# EAGLE design controller2 (EAGLE 6.3)
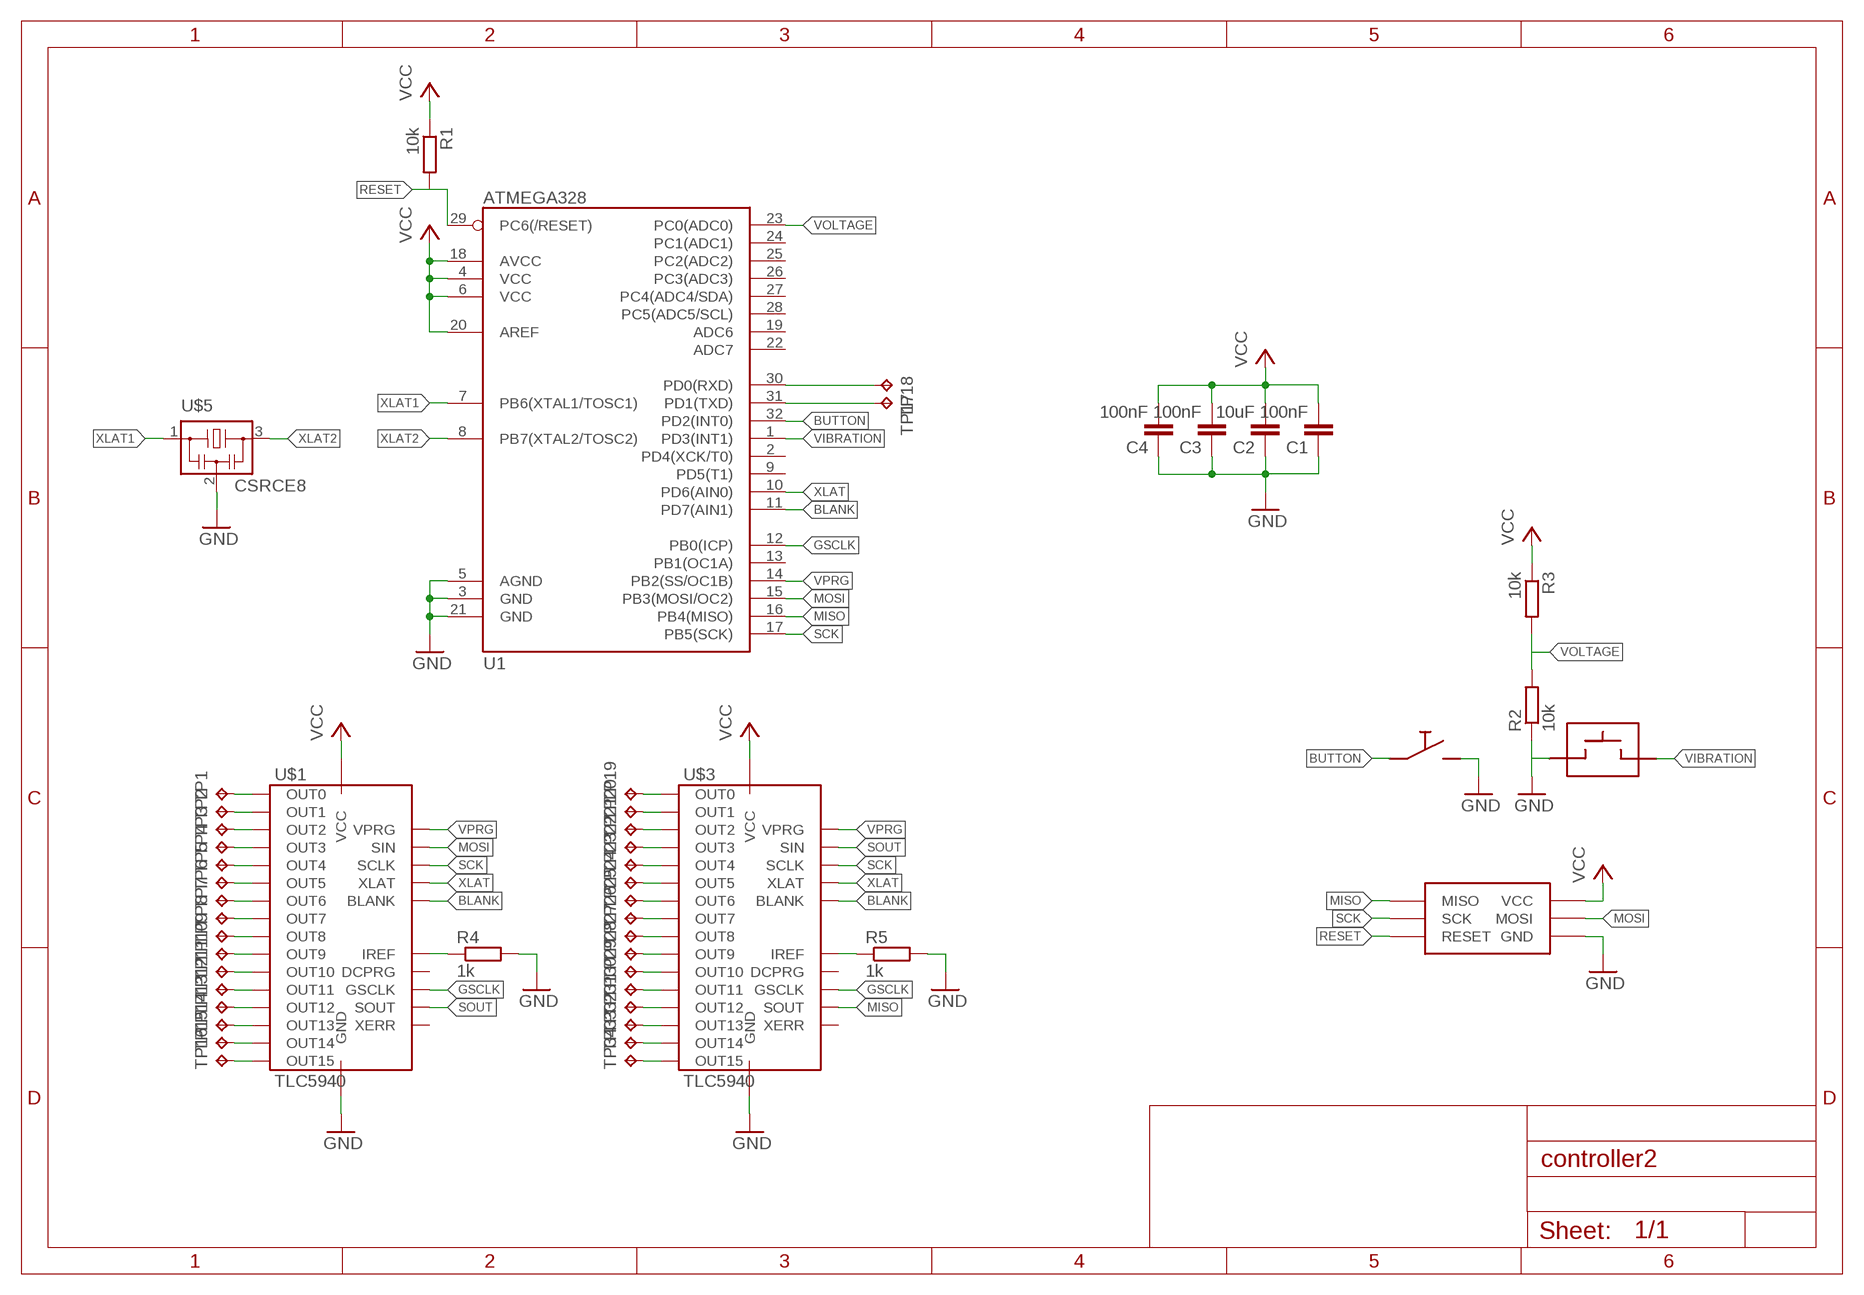
[diagram p0: schematic, sheet 1]

## Parts
C1  100nF  C-EUC0603  [C0603]
C2  10uF  C-EUC0805  [C0805]
C3  100nF  C-EUC0603  [C0603]
C4  100nF  C-EUC0603  [C0603]
R1  10k  R-EU_R0603  [R0603]
R2  10k  R-EU_R0603  [R0603]
R3  10k  R-EU_R0603  [R0603]
R4  1k  R-EU_R0603  [R0603]
R5  1k  R-EU_R0603  [R0603]
TP1  TPTP15SQ  [TP15SQ]
TP2  TPTP15SQ  [TP15SQ]
TP3  TPTP15SQ  [TP15SQ]
TP4  TPTP15SQ  [TP15SQ]
TP5  TPTP15SQ  [TP15SQ]
TP6  TPTP15SQ  [TP15SQ]
TP7  TPTP15SQ  [TP15SQ]
TP8  TPTP15SQ  [TP15SQ]
TP9  TPTP15SQ  [TP15SQ]
TP10  TPTP15SQ  [TP15SQ]
TP11  TPTP15SQ  [TP15SQ]
TP12  TPTP15SQ  [TP15SQ]
TP13  TPTP15SQ  [TP15SQ]
TP14  TPTP15SQ  [TP15SQ]
TP15  TPTP15SQ  [TP15SQ]
TP16  TPTP15SQ  [TP15SQ]
TP17  TPTP15SQ  [TP15SQ]
TP18  TPTP15SQ  [TP15SQ]
TP19  TPTP15SQ  [TP15SQ]
TP20  TPTP15SQ  [TP15SQ]
TP21  TPTP15SQ  [TP15SQ]
TP22  TPTP15SQ  [TP15SQ]
TP23  TPTP15SQ  [TP15SQ]
TP24  TPTP15SQ  [TP15SQ]
TP25  TPTP15SQ  [TP15SQ]
TP26  TPTP15SQ  [TP15SQ]
TP27  TPTP15SQ  [TP15SQ]
TP28  TPTP15SQ  [TP15SQ]
TP29  TPTP15SQ  [TP15SQ]
TP30  TPTP15SQ  [TP15SQ]
TP31  TPTP15SQ  [TP15SQ]
TP32  TPTP15SQ  [TP15SQ]
TP33  TPTP15SQ  [TP15SQ]
TP34  TPTP15SQ  [TP15SQ]
U1  ATMEGA328  [TQFP32-08]
U$1  TLC5940  [PWP_28PIN]
U$2  ISP_SPECIALS  [ISP_RM2_00_STRAIGHT]
U$3  TLC5940  [PWP_28PIN]
U$4  MOTION_SENSOR  [MOTION]
U$5  CSRCE8  [CSTCE_G]
U$6  SWITCH  [EVQPSG02K]

## Nets
BLANK: U1.11(PD7(AIN1)) U$1.P2(BLANK) U$3.P2(BLANK)
BUTTON: U1.32(PD2(INT0)) U$6.A U$6.A@2
GND: C1.1 C2.1 C3.1 C4.1 R2.1 R4.2 R5.2 U1.3(GND) U1.5(AGND) U1.21(GND) U$1.P1(GND) U$1.P29(GND) U$2.VCC(GND) U$3.P1(GND) U$3.P29(GND) U$4.P$1(IN) U$5.2 U$6.B U$6.B@2
GSCLK: U1.12(PB0(ICP)) U$1.P25(GSCLK) U$3.P25(GSCLK)
MISO: U1.16(PB4(MISO)) U$2.RESET(MISO) U$3.P24(SOUT)
MOSI: U1.15(PB3(MOSI/OC2)) U$1.P5(SIN) U$2.MOSI
N$1: TP1.TP U$1.P7(OUT0)
N$2: TP2.TP U$1.P8(OUT1)
N$3: TP3.TP U$1.P9(OUT2)
N$5: TP4.TP U$1.P10(OUT3)
N$6: TP5.TP U$1.P11(OUT4)
N$7: TP6.TP U$1.P12(OUT5)
N$8: R4.1 U$1.P27(IREF)
N$9: TP7.TP U$1.P13(OUT6)
N$10: TP8.TP U$1.P14(OUT7)
N$11: TP9.TP U$1.P15(OUT8)
N$12: TP10.TP U$1.P16(OUT9)
N$13: TP11.TP U$1.P17(OUT10)
N$14: TP12.TP U$1.P18(OUT11)
N$15: TP13.TP U$1.P19(OUT12)
N$16: TP14.TP U$1.P20(OUT13)
N$17: TP15.TP U$1.P21(OUT14)
N$18: TP16.TP U$1.P22(OUT15)
N$19: R5.1 U$3.P27(IREF)
N$20: TP19.TP U$3.P7(OUT0)
N$21: TP20.TP U$3.P8(OUT1)
N$24: TP21.TP U$3.P9(OUT2)
N$25: TP22.TP U$3.P10(OUT3)
N$26: TP23.TP U$3.P11(OUT4)
N$27: TP24.TP U$3.P12(OUT5)
N$28: TP25.TP U$3.P13(OUT6)
N$29: TP26.TP U$3.P14(OUT7)
N$30: TP27.TP U$3.P15(OUT8)
N$31: TP28.TP U$3.P16(OUT9)
N$32: TP29.TP U$3.P17(OUT10)
N$33: TP30.TP U$3.P18(OUT11)
N$34: TP31.TP U$3.P19(OUT12)
N$35: TP32.TP U$3.P20(OUT13)
N$36: TP33.TP U$3.P21(OUT14)
N$37: TP34.TP U$3.P22(OUT15)
RESET: R1.2 U1.29(PC6(/RESET)) U$2.MISO(RESET)
RX: TP18.TP U1.30(PD0(RXD))
SCK: U1.17(PB5(SCK)) U$1.P4(SCLK) U$2.SCK U$3.P4(SCLK)
SOUT: U$1.P24(SOUT) U$3.P5(SIN)
TX: TP17.TP U1.31(PD1(TXD))
VCC: C1.2 C2.2 C3.2 C4.2 R1.1 R3.1 U1.4(VCC) U1.6(VCC) U1.18(AVCC) U1.20(AREF) U$1.P28(VCC) U$2.GND(VCC) U$3.P28(VCC)
VIBRATION: U1.1(PD3(INT1)) U$4.P$2(OUT)
VOLTAGE: R2.2 R3.2 U1.23(PC0(ADC0))
VPRG: U1.14(PB2(SS/OC1B)) U$1.P6(VPRG) U$3.P6(VPRG)
XLAT: U1.10(PD6(AIN0)) U$1.P3(XLAT) U$3.P3(XLAT)
XLAT1: U1.7(PB6(XTAL1/TOSC1)) U$5.1
XLAT2: U1.8(PB7(XTAL2/TOSC2)) U$5.3
Unconnected: U1.2(PD4(XCK/T0)) U1.9(PD5(T1)) U1.13(PB1(OC1A)) U1.19(ADC6) U1.22(ADC7) U1.24(PC1(ADC1)) U1.25(PC2(ADC2)) U1.26(PC3(ADC3)) U1.27(PC4(ADC4/SDA)) U1.28(PC5(ADC5/SCL)) U$1.P23(XERR) U$1.P26(DCPRG) U$3.P23(XERR) U$3.P26(DCPRG)

## Library data of the parts
C1-C4 = rcl:C-EU: CAPACITOR, European symbol
R1-R5 = rcl:R-EU_: RESISTOR, European symbol
TP1-TP34 = testpad:TP: Test pad
U1 = thecustomgeek:ATMEGA328: ATmega328P-AU TQFP 32 pin
U$1 U$3 = niklas:TLC5940
U$2 = bookla:ISP_SPECIAL
U$4 = bookla:MOTION_SENSOR
U$5 = bookla:CSRCE8
U$6 = bookla:SWITCH

## Board
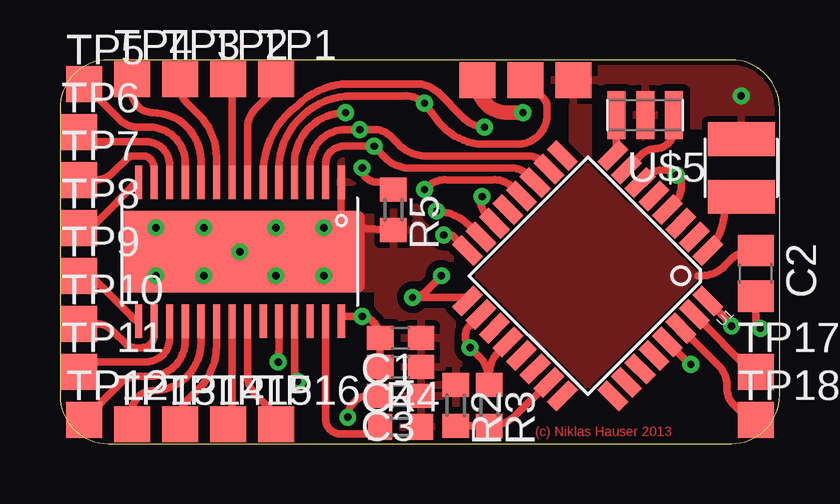
[diagram p1: board, top side]
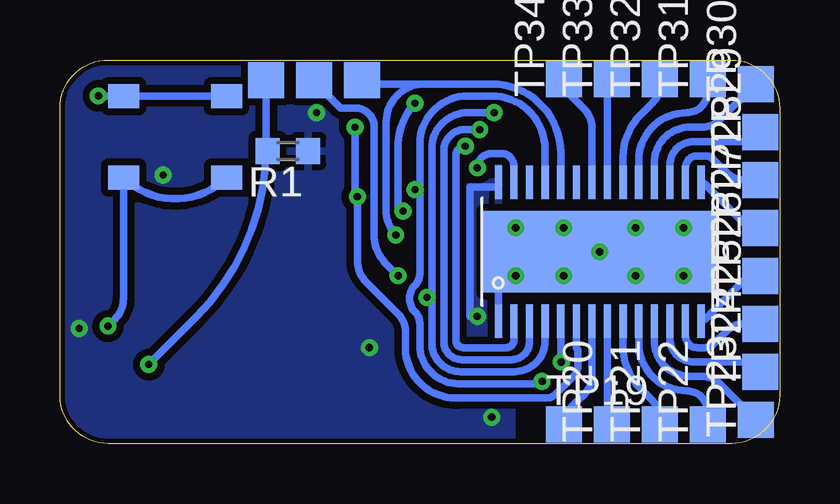
[diagram p2: board, bottom side, seen from below]

Size 30 x 16 mm. Coordinates in mm from the lower left corner, seen from the top.
Outline: 0,14 0,2 arc90 2,0 28,0 arc90 30,2 30,14 arc90 28,16 2,16 arc90 0,14
Copper layers (1*16): Top 0.035mm / dielectric 1.5mm / Bottom 0.035mm
Design rules "default *": minimum track width 10mil, minimum drill 24mil, track to track 12mil, track to pad 10mil, pad to pad 8mil, via to via 8mil, smd to smd 8mil, copper to edge 8mil, drill to drill 8mil, minimum pad ring 10mil, minimum via ring 8mil, stop-mask expansion 4mil, vias tented up to drill 0mil, thermal gap 10mil
tRestrict: area 1,6 to 3,10; area 8,0 to 11,4; area 2.6,5.4 to 12.4,10.7; area 12.4,9.6 to 13.3,10.7; area 12.4,5.5 to 13.1,6.3; area 26.9,5.8 to 29.9,9.6; area 26,9.6 to 29.9,13.1; area 20.5,12.5 to 21.2,14.2; area 22.2,11.7 to 22.9,14.4
bRestrict: area 8,0 to 11,4

### Footprints (pad centres in the part's own frame; a part is rotated, then mirrored left to right if it is on the bottom)
C0603 = smd 1.1 x 1: 1 -0.85,0; 2 0.85,0
C0805 = smd 1.3 x 1.5: 1 -0.95,0; 2 0.95,0
R0603 = smd 1 x 1.1: 1 -0.85,0; 2 0.85,0
TP15SQ = smd 1.5 x 1.5: TP 0,0
TQFP32-08 = smd 1.27 x 0.559: 1 -4.293,2.8; 2 -4.293,2; 3 -4.293,1.2; 4 -4.293,0.4; 5 -4.293,-0.4; 6 -4.293,-1.2; 7 -4.293,-2; 8 -4.293,-2.8; 17 4.293,-2.8; 18 4.293,-2; 19 4.293,-1.2; 20 4.293,-0.4; 21 4.293,0.4; 22 4.293,1.2; 23 4.293,2; 24 4.293,2.8 | smd 0.559 x 1.27: 9 -2.8,-4.293; 10 -2,-4.293; 11 -1.2,-4.293; 12 -0.4,-4.293; 13 0.4,-4.293; 14 1.2,-4.293; 15 2,-4.293; 16 2.8,-4.293; 25 2.8,4.293; 26 2,4.293; 27 1.2,4.293; 28 0.4,4.293; 29 -0.4,4.293; 30 -1.2,4.293; 31 -2,4.293; 32 -2.8,4.293
PWP_28PIN = smd 0.3 x 1.4: P1 -4.225,-2.9; P2 -3.575,-2.9; P3 -2.925,-2.9; P4 -2.275,-2.9; P5 -1.625,-2.9; P6 -0.975,-2.9; P7 -0.325,-2.9; P8 0.325,-2.9; P9 0.975,-2.9; P10 1.625,-2.9; P11 2.275,-2.9; P12 2.925,-2.9; P13 3.575,-2.9; P14 4.225,-2.9; P15 4.225,2.9; P16 3.575,2.9; P17 2.925,2.9; P18 2.275,2.9; P19 1.625,2.9; P20 0.975,2.9; P21 0.325,2.9; P22 -0.325,2.9; P23 -0.975,2.9; P24 -1.625,2.9; P25 -2.275,2.9; P26 -2.925,2.9; P27 -3.575,2.9; P28 -4.225,2.9 | smd 9.7 x 3.4: P29 0,0
ISP_RM2_00_STRAIGHT = smd 1.5 x 1.5 bottom: GND 2,-0.85; MOSI 0,-0.85; VCC -2,-0.85 | smd 1.5 x 1.5: MISO -2,-0.85; RESET 2,-0.85; SCK 0,-0.85
MOTION = smd 1.4 x 2.8: P$1 -1.2,0; P$2 1.2,0
CSTCE_G = smd 0.75 x 2: 1 -1.2,0; 2 0,0; 3 1.2,0
EVQPSG02K = smd 1 x 1.3: A -1.7,2.15; A@2 -1.7,-2.15; B 1.7,2.15; B@2 1.7,-2.15

### Placement (x,y rotation side)
C1  14.2,4.4 180 top
C2  29,7.1 270 top
C3  14.2,2 180 top
C4  14.2,3.2 180 top
R1  20.5,12.2 180 bottom
R2  16.5,1.6 270 top
R3  17.9,1.6 270 top
R4  14.2,0.7 0 top
R5  13.9,9.75 270 top
TP1  9,15.2 0 top
TP2  7,15.2 0 top
TP3  5,15.2 0 top
TP4  3,15.2 0 top
TP5  1,15 0 top
TP6  0.8,13 0 top
TP7  0.8,11 0 top
TP8  0.8,9 0 top
TP9  0.8,7 0 top
TP10  0.8,5 0 top
TP11  0.8,3 0 top
TP12  1,1 0 top
TP13  3,0.8 0 top
TP14  5,0.8 0 top
TP15  7,0.8 0 top
TP16  9,0.8 0 top
TP17  29,3 0 top
TP18  29,1 0 top
TP19  9,0.8 0 bottom
TP20  7,0.8 90 bottom
TP21  5,0.8 90 bottom
TP22  3,0.8 90 bottom
TP23  1,1 90 bottom
TP24  0.8,3 90 bottom
TP25  0.8,5 90 bottom
TP26  0.8,7 90 bottom
TP27  0.8,9 90 bottom
TP28  0.8,11 90 bottom
TP29  0.8,13 90 bottom
TP30  1,15 90 bottom
TP31  3,15.2 90 bottom
TP32  5,15.2 90 bottom
TP33  7,15.2 90 bottom
TP34  9,15.2 90 bottom
U1  22,7 225 top
U$1  7.5,8 180 top
U$2  19.4,16 0 bottom
U$3  7.5,8 0 bottom
U$4  28.4,11.5 270 top
U$5  24.4,13.7 180 top
U$6  25.2,12.8 90 bottom

### Tracks (layer width: path | path; a pad name or v marks a point on that pad's centre or on a via)
BLANK  (via drill 0.3)
  Top 0.305: v13.1,12.4 11.82,12.4 arc90 11.07,11.65 U$1.P2 | 13.13,12.37 v13.1,12.4 | U1.11 19.47,11.23 arc45 18.77,11.5 14.4,11.5 arc-45 13.35,12.15 v13.1,12.4
  Bottom 0.305: U$3.P2 11.07,4.32 arc90 11.39,4 13.18,4 arc90 13.5,4.32 13.5,12 arc90 v13.1,12.4
BUTTON  (via drill 0.3)
  Top 0.305: v28,4.9 arc45 27.96,5 U1.32
  Bottom 0.305: U$6.A@2 arc90 U$6.A 27.35,6.08 arc45 27.72,5.18 v28,4.9
GND  (via drill 0.3)
  Top 0.305: U$1.P1 11.72,9.72 | 11.72,9.72 arc-90 v11,9 | 11.72,9.72 11.72,9.68 arc90 12.4,9 R5.2 | C2.1 28.88,8.05 arc45 27.98,7.68 27.7,7.4 27.67,7.37 arc-45 26.77,7 26.6,7
  Top 0.61: 12.4,9.4 12.4,9 12.4,6.6
  Bottom 0.305: U$3.P1 11.72,7 | 11.72,7 v11,7 | U$6.B@2 U$6.B v28.4,14.5 | v4,9 v6,9 6.5,9 arc-90 U$3.P29 | v4,7 v6,7 6.5,7 arc90 U$3.P29 | U$3.P29 8,8 | 8,8 arc-90 v9,7 | U$3.P29 8,8 | 8,8 arc90 v9,9 v11,9 v11,7 | 11.72,7 v11,7
  other vias: 7.5,8
  pour Top: 0,16 30,16 30,0 0,0
GSCLK  (via drill 0.3)
  Top 0.305: U$1.P25 9.78,3.9 9.78,2.9 arc45 v9.9,2.6 | 19.22,10.38 arc-45 U1.12 | U1.12 19.24,10.33 | 19.24,10.33 19.08,10.49 18.84,10.73 arc45 18.04,11 17.2,11 16.13,11 arc45 15.33,10.73 v15.2,10.6 | 19.24,10.33 U1.12
  Bottom 0.305: 15,10.6 15,12.5 arc90 13,14.5 12,14.5 arc90 9.78,12.28 U$3.P25 | 15,10.6 15,7.08 arc45 15.2,6.6 arc-90 15.2,5.5 arc45 15,5.02 15,4.1 arc-90 13.4,2.5 13.35,2.5 12.9,2.5 10.52,2.5 10.14,2.5 arc-45 v9.9,2.6 | 15,10.6 v15.2,10.6
MISO  (via drill 0.3)
  Top 0.305: U1.16 16.37,8.67 arc45 v16,8.7
  Bottom 0.305: U$3.P24 9.12,12.12 arc-90 12,15 13,15 14.8,15 | 14.8,15 arc-90 16.4,13.4 16.4,11.5 16.4,9.75 arc-45 v16,8.7 | U$2.RESET arc-45 17.04,15 14.8,15
MOSI  (via drill 0.3)
  Top 0.305: v15.2,14.2 arc45 14.38,14.5 12.2,14.5 arc90 9.12,11.43 U$1.P5 | v15.2,14.2 15.19,14.21 arc45 v15.2,14.2 | U1.15 17.23,8.94 arc45 v15.7,9.7 | 17.44,12.5 17.43,12.5 | 17.43,12.5 17.44,12.5 | 17.44,12.5 19.2,12.5 arc90 20.3,13.8 20.3,14.1 arc45 20.19,14.36 U$2.MOSI | 17.44,12.5 17.43,12.5 | 17.43,12.5 arc-45 15.83,13.37 v15.2,14.2
  Bottom 0.305: v15.2,14.2 arc-45 15.9,12.27 15.9,12.04 15.9,9.9 arc-90 v15.7,9.7
N$1
  Top 0.305: U$1.P7 7.83,13.21 arc-45 8.12,13.92 8.56,14.36 8.85,14.65 arc45 9,15.01 TP1.TP
N$2
  Top 0.305: U$1.P8 7.17,14.82 TP2.TP
N$3
  Top 0.305: U$1.P9 6.53,11.94 arc45 5.79,13.71 5.29,14.21 arc-45 5,14.91 TP3.TP
N$5
  Top 0.305: 3,14.81 TP4.TP 3,14.68 arc90 3.88,13.8 arc-90 5.88,11.8 U$1.P10
N$6
  Top 0.305: TP5.TP 2.51,13.49 arc45 3.21,13.2 3.73,13.2 arc-90 5.22,11.7 U$1.P11
N$7
  Top 0.305: TP6.TP 1.4,12.6 3.58,12.6 arc-90 4.58,11.6 U$1.P12
N$8
  Top 0.305: U$1.P27 11.07,1.02 arc90 11.7,0.4 13.1,0.4 arc90 R4.1
N$9
  Top 0.305: TP7.TP 1.49,11 arc45 2.19,11.29 2.75,11.85 arc-45 3.11,12 3.42,12 arc-90 3.92,11.5 U$1.P13
N$10
  Top 0.305: U$1.P14 arc45 2.98,10.68 1.79,9.49 1.3,9 TP8.TP
N$11
  Top 0.305: U$1.P15 arc-45 2.98,5.32 1.59,6.71 1.3,7 TP9.TP 0.89,7
N$12
  Top 0.305: TP10.TP 1.49,5 arc-45 2.19,4.71 2.75,4.15 arc45 3.11,4 3.42,4 arc90 3.92,4.5 U$1.P16
N$13
  Top 0.305: TP11.TP 1.4,3.4 3.58,3.4 arc90 4.58,4.4 U$1.P17
N$14
  Top 0.305: TP12.TP 2.51,2.51 arc-45 3.21,2.8 3.73,2.8 arc90 5.22,4.3 U$1.P18
N$15
  Top 0.305: 3,1.19 TP13.TP 3,1.32 arc-90 3.88,2.2 arc90 5.88,4.2 U$1.P19
N$16
  Top 0.305: U$1.P20 6.53,4.06 arc-45 5.79,2.29 5.29,1.79 arc45 5,1.09 TP14.TP
N$17
  Top 0.305: U$1.P21 7.17,1.18 TP15.TP
N$18
  Top 0.305: U$1.P22 7.83,2.79 arc45 8.12,2.08 8.72,1.48 arc-45 TP16.TP
N$19  (via drill 0.3)
  Top 0.305: v12.6,11.5 arc90 13.2,10.9 13.9,10.9 R5.1
  Bottom 0.305: U$3.P27 11.07,11.57 arc-90 11.6,12.1 12,12.1 arc-90 v12.6,11.5
N$20
  Bottom 0.305: U$3.P7 7.83,2.79 arc45 8.12,2.08 8.46,1.74 9,1.2 TP19.TP
N$21
  Bottom 0.305: U$3.P8 7.17,1.18 TP20.TP
N$24
  Bottom 0.305: U$3.P9 6.53,4.06 arc-45 5.79,2.29 5.29,1.79 arc45 5,1.09 TP21.TP
N$25
  Bottom 0.305: 3,1.19 TP22.TP 3,1.32 arc-90 3.88,2.2 arc90 5.88,4.2 U$3.P10
N$26
  Bottom 0.305: TP23.TP 2.51,2.51 arc-45 3.21,2.8 3.73,2.8 arc90 5.22,4.3 U$3.P11
N$27
  Bottom 0.305: TP24.TP 1.4,3.4 3.58,3.4 arc90 4.58,4.4 U$3.P12
N$28
  Bottom 0.305: TP25.TP 1.49,5 arc-45 2.19,4.71 2.75,4.15 arc45 3.11,4 3.42,4 arc90 3.92,4.5 U$3.P13
N$29
  Bottom 0.305: U$3.P14 arc-45 2.98,5.32 1.7,6.6 1.3,7 TP26.TP
N$30
  Bottom 0.305: U$3.P15 arc45 2.98,10.68 1.6,9.3 1.59,9.29 1.3,9 TP27.TP 0.89,9
N$31
  Bottom 0.305: TP28.TP 1.49,11 arc45 2.19,11.29 2.75,11.85 arc-45 3.11,12 3.42,12 arc-90 3.92,11.5 U$3.P16
N$32
  Bottom 0.305: TP29.TP 1.4,12.6 3.58,12.6 arc-90 4.58,11.6 U$3.P17
N$33
  Bottom 0.305: TP30.TP 2.51,13.49 arc45 3.21,13.2 3.73,13.2 arc-90 5.22,11.7 U$3.P18
N$34
  Bottom 0.305: 3,14.81 TP31.TP 3,14.68 arc90 3.88,13.8 arc-90 5.88,11.8 U$3.P19
N$35
  Bottom 0.305: 5,14.91 TP32.TP 5,14.91 | U$3.P20 6.53,11.94 arc45 5.79,13.71 5.29,14.21 arc-45 5,14.91
N$36
  Bottom 0.305: U$3.P21 7.17,14.82 TP33.TP
N$37
  Bottom 0.305: U$3.P22 7.83,13.21 arc-45 8.12,13.92 8.56,14.36 8.85,14.65 arc45 9,15.01 TP34.TP
RESET  (via drill 0.3)
  Top 0.305: v26.3,3.3 arc-45 26.24,3.32 U1.29
  Bottom 0.305: U$2.MISO 21.4,12.34 | 21.4,12.34 arc45 24.33,5.27 v26.3,3.3 | 21.4,12.34 21.4,12.32 arc-45 R1.2
RX
  Top 0.305: U1.30 27.51,3.19 arc-45 27.8,2.48 27.8,2.31 arc45 28.09,1.61 28.7,1 TP18.TP
SCK  (via drill 0.3)
  Top 0.305: U1.17 arc-90 16.94,6.1 16,6.1 v14.7,6.1 arc45 15.21,6.31 v15.9,7 | U$1.P4 9.78,11.68 arc-90 v11.9,13.8
  Bottom 0.305: U$3.P4 9.78,4.27 arc90 11.04,3 13.3,3 arc90 14.5,4.2 14.5,6.1 | 14.5,6.1 14.5,12.3 arc90 13,13.8 v11.9,13.8 | v14.7,6.1 14.5,6.1 | U$2.SCK arc-45 19.36,15.06 18.3,14 17.7,14 arc90 16.9,13.2 16.9,8.6 arc-45 16.33,7.43 v15.9,7
SOUT  (via drill 0.3)
  Top 0.305: U$3.P5 9.12,3.94 arc-5 v9.1,3.4
  Bottom 0.305: U$3.P5 9.12,3.94 arc-5 v9.1,3.4
TX
  Top 0.305: U1.31 28.83,3 TP17.TP
VCC  (via drill 0.3)
  Top 0.305: 11.72,5.3 U$1.P28 11.72,5.3 | 11.72,5.3 v12.6,5.3 arc-90 13.3,4.4 13.3,4.3 13.31,4.18 arc-45 C1.2 C4.2 C3.2 12.9,2 arc90 v12,1.1 | U1.20 18.34,3.9 arc45 17.9,2.84 R3.1 17.9,2.58 arc45 17.46,3.64 v17.1,4 arc-45 16.9,4.48 16.9,4.5 arc-45 17.06,4.89 U1.18 | C2.2 29,5.28 arc45 v29.2,4.8 | U1.6 24.42,11.12 arc-45 25.1,11.4 25.5,11.4 arc-90 v25.7,11.2 arc-90 25.9,11 25.9,10.7 arc-45 25.64,10.08 U1.4
  Top 0.61: U$2.GND arc90 18.55,13.8 v19.3,13.8
  Bottom 0.305: U$3.P28 11.72,10.7 12.9,10.7 12.9,5.3 v12.6,5.3
  pour Bottom: 0,16 30,16 30,0 0,0
VIBRATION
  Top 0.305: U1.1 U1.1 arc45 27.7,9.7 28.23,10.23 arc-45 U$4.P$2
VOLTAGE
  Top 0.305: R2.2 R3.2 17.96,0.75 arc45 19.02,1.19 U1.23
VPRG  (via drill 0.3)
  Top 0.305: v17.7,13.2 arc-45 16.85,13.55 16.8,13.6 15.77,14.63 arc45 14.87,15 12,15 arc45 9.9,14.1 arc50 8.47,11.47 U$1.P6 | v17.6,10.3 17.5,10.23 arc45 17.87,9.43 U1.14
  Bottom 0.305: v17.7,13.2 17.7,10.58 arc-45 v17.6,10.3 17.6,7.63 arc-45 17.23,6.73 16.5,6 15.88,5.38 arc45 15.6,4.7 15.6,4 arc-90 13.5,1.9 10.17,1.9 9.7,1.9 arc-45 9.36,2.04 8.6,2.8 arc-45 8.4,3.28 8.4,3.9 arc45 8.47,4.08 U$3.P6
XLAT  (via drill 0.3)
  Top 0.305: U$1.P3 10.43,11.6 arc-90 11.93,13.1 v12.5,13.1 13.08,13.1 arc-45 13.8,12.8 14.09,12.51 arc45 15.2,12 19.6,12 arc-45 20.1,11.73 U1.10
  Bottom 0.305: U$3.P3 10.43,4.25 arc90 11.18,3.5 13.25,3.5 arc90 14,4.25 14,12.2 arc90 13.1,13.1 v12.5,13.1
XLAT1
  Top 0.305: U1.7 24.21,12.04 arc-45 24.9,12.3 arc90 25.6,13.2 U$5.1
XLAT2
  Top 0.305: U$5.3 23.2,12.36 arc-45 U1.8

### Text on the board
Top: (c) Niklas Hauser 2013